# Altium schematic sheet Mico_SDCard_SPI.SchDoc
size A4
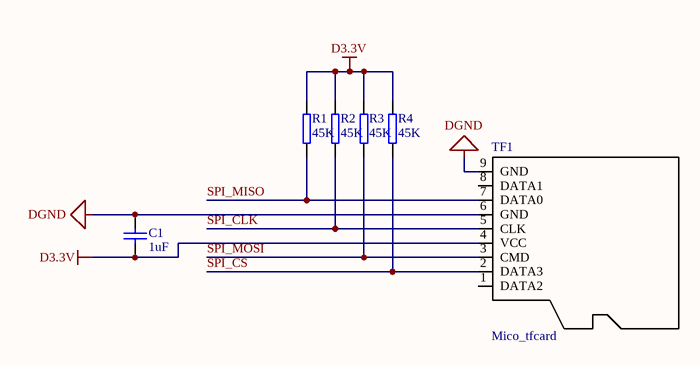
[diagram p0: Mico_SDCard_SPI.SchDoc]

## Parts
C1  1uF  [0603C]
R1  45K  [2512R]
R2  45K  [0402R]
R3  45K  [0402R]
R4  45K  [0402R]
TF1  Mico_tfcard  [Micro_SDCard]

## Nets
D3.3V: C1.1 R1.2 R2.2 R3.2 R4.2 TF1.4(VCC)
DGND: C1.2 TF1.6(GND) TF1.9(GND)
SPI_CLK: R2.1 TF1.5(CLK)
SPI_CS: R4.1 TF1.2(DATA3)
SPI_MISO: R1.1 TF1.7(DATA0)
SPI_MOSI: R3.1 TF1.3(CMD)

Not connected (* = marked no-connect by the designer): TF1 1(DATA2) 8(DATA1)

## Library data of the parts
C1 = Cap: 贴片电容
R1-R4 = RES-10K